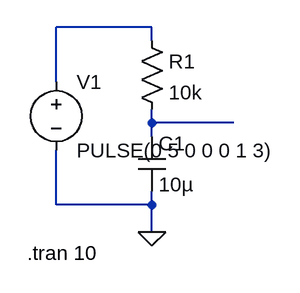
[diagram p0: schematic ConductivityGenerator.asc]
ConductivityGenerator.asc, the LTspice schematic file:
Version 4
SHEET 1 880 680
WIRE 224 32 112 32
WIRE 224 48 224 32
WIRE 112 96 112 32
WIRE 224 144 224 128
WIRE 320 144 224 144
WIRE 224 160 224 144
WIRE 112 240 112 176
WIRE 224 240 224 224
WIRE 224 240 112 240
WIRE 224 272 224 240
FLAG 224 272 0
SYMBOL cap 208 160 R0
SYMATTR InstName C1
SYMATTR Value 10µ
SYMATTR SpiceLine2 IC=2.5
SYMBOL res 208 32 R0
SYMATTR InstName R1
SYMATTR Value 10k
SYMBOL voltage 112 80 R0
WINDOW 123 0 0 Left 0
WINDOW 39 0 0 Left 0
SYMATTR InstName V1
SYMATTR Value PULSE(0 5 0 0 0 1 3)
TEXT 78 296 Left 2 !.tran 10

The netlist it stands for:
* ConductivityGenerator.asc
C1 N002 0 10µ IC=2.5
R1 N001 N002 10k
V1 N001 0 PULSE(0 5 0 0 0 1 3)
.tran 10
.backanno
.end